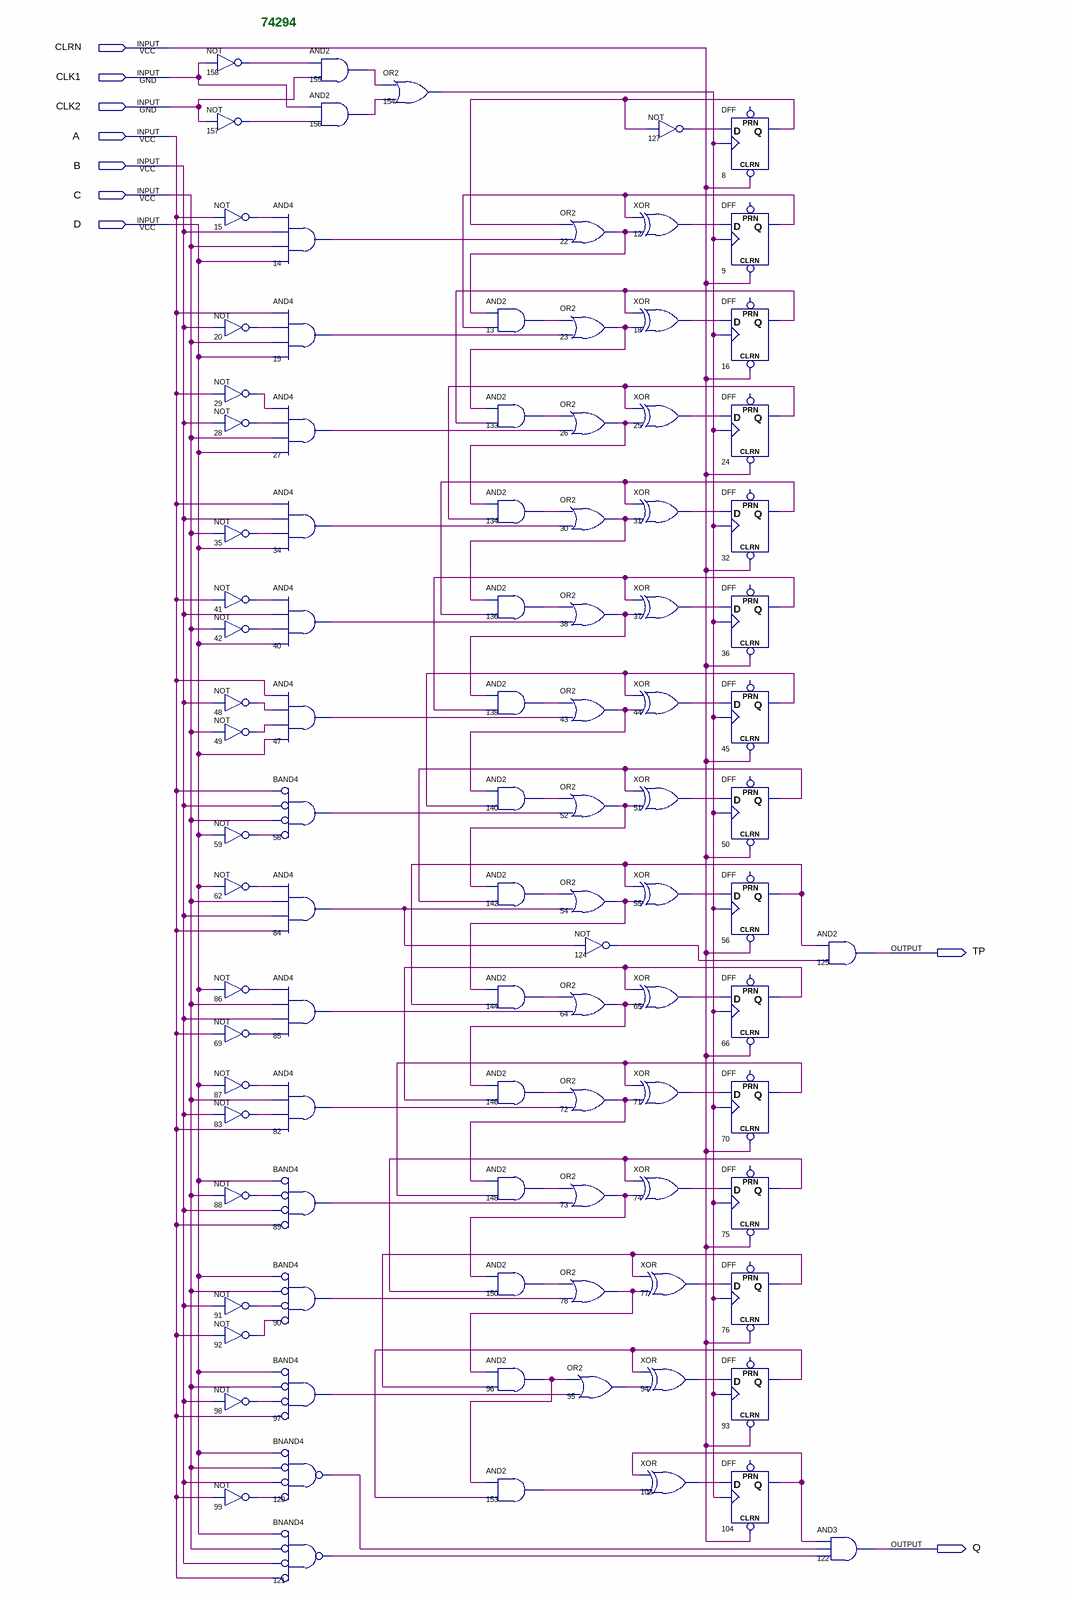
[diagram p0: schematic sheet]
// Quartus schematic 74294.bdf as structural Verilog: 99 symbols, 9 pins
module \74294  (
  input  CLRN,
  input  CLK1,
  input  CLK2,
  input  A,
  input  B,
  input  C,
  input  D,
  output TP,
  output Q
);

  wire n8_q, n9_q, n12_out, n13_out, n14_out, n15_out, n16_q, n18_out, n19_out, n20_out, n22_out, n23_out,
       n24_q, n25_out, n26_out, n27_out, n28_out, n29_out, n30_out, n31_out, n32_q, n34_out, n35_out, n36_q,
       n37_out, n38_out, n40_out, n41_out, n42_out, n43_out, n44_out, n45_q, n47_out, n48_out, n49_out,
       n50_q, n51_out, n52_out, n54_out, n55_out, n56_q, n58_out, n59_out, n62_out, n64_out, n65_out, n66_q,
       n69_out, n70_q, n71_out, n72_out, n73_out, n74_out, n75_q, n76_q, n77_out, n78_out, n82_out, n83_out,
       n84_out, n85_out, n86_out, n87_out, n88_out, n89_out, n90_out, n91_out, n92_out, n93_q, n94_out,
       n95_out, n96_out, n97_out, n98_out, n99_out, n103_out, n104_q, n120_out, n121_out, n124_out, n127_out,
       n133_out, n134_out, n136_out, n138_out, n140_out, n142_out, n144_out, n146_out, n148_out, n150_out,
       n153_out, n154_out, n155_out, n156_out, n157_out, n158_out;

  not u_158 (n158_out, CLK1);
  not u_157 (n157_out, CLK2);
  not u_15 (n15_out, A);
  not u_20 (n20_out, B);
  not u_29 (n29_out, A);
  not u_28 (n28_out, B);
  not u_35 (n35_out, C);
  not u_41 (n41_out, A);
  not u_42 (n42_out, C);
  not u_48 (n48_out, B);
  not u_49 (n49_out, C);
  not u_59 (n59_out, D);
  not u_62 (n62_out, D);
  not u_86 (n86_out, D);
  not u_69 (n69_out, A);
  not u_87 (n87_out, D);
  not u_83 (n83_out, B);
  not u_88 (n88_out, C);
  not u_91 (n91_out, B);
  not u_92 (n92_out, A);
  not u_98 (n98_out, B);
  not u_99 (n99_out, A);
  and u_14 (n14_out, n15_out, B, C, D);
  and u_19 (n19_out, A, n20_out, C, D);
  and u_27 (n27_out, n29_out, n28_out, C, D);
  and u_34 (n34_out, A, B, n35_out, D);
  and u_40 (n40_out, n41_out, B, n42_out, D);
  and u_47 (n47_out, A, n48_out, n49_out, D);
  and u_58 (n58_out, ~A, ~B, ~C, ~n59_out);  // BAND4
  and u_84 (n84_out, n62_out, C, B, A);
  and u_85 (n85_out, n86_out, C, B, n69_out);
  and u_82 (n82_out, n87_out, C, n83_out, A);
  and u_89 (n89_out, ~D, ~n88_out, ~B, ~A);  // BAND4
  and u_90 (n90_out, ~D, ~C, ~n91_out, ~n92_out);  // BAND4
  and u_97 (n97_out, ~D, ~C, ~n98_out, ~A);  // BAND4
  nand u_120 (n120_out, ~D, ~C, ~B, ~n99_out);  // BNAND4
  nand u_121 (n121_out, ~D, ~C, ~B, ~A);  // BNAND4
  and u_155 (n155_out, n158_out, CLK2);
  and u_156 (n156_out, CLK1, n157_out);
  or u_154 (n154_out, n155_out, n156_out);
  and u_13 (n13_out, n22_out, n9_q);
  and u_133 (n133_out, n23_out, n16_q);
  and u_134 (n134_out, n26_out, n24_q);
  and u_136 (n136_out, n30_out, n32_q);
  and u_138 (n138_out, n38_out, n36_q);
  and u_140 (n140_out, n43_out, n45_q);
  and u_142 (n142_out, n52_out, n50_q);
  and u_144 (n144_out, n54_out, n56_q);
  and u_146 (n146_out, n64_out, n66_q);
  and u_148 (n148_out, n72_out, n70_q);
  and u_150 (n150_out, n73_out, n75_q);
  and u_96 (n96_out, n78_out, n76_q);
  and u_153 (n153_out, n96_out, n93_q);
  or u_22 (n22_out, n8_q, n14_out);
  or u_23 (n23_out, n13_out, n19_out);
  or u_26 (n26_out, n133_out, n27_out);
  or u_30 (n30_out, n134_out, n34_out);
  or u_38 (n38_out, n136_out, n40_out);
  or u_43 (n43_out, n138_out, n47_out);
  or u_52 (n52_out, n140_out, n58_out);
  or u_54 (n54_out, n142_out, n84_out);
  not u_124 (n124_out, n84_out);
  or u_64 (n64_out, n144_out, n85_out);
  or u_72 (n72_out, n146_out, n82_out);
  or u_73 (n73_out, n148_out, n89_out);
  or u_78 (n78_out, n150_out, n90_out);
  or u_95 (n95_out, n96_out, n97_out);
  xor u_12 (n12_out, n9_q, n22_out);
  xor u_18 (n18_out, n16_q, n23_out);
  xor u_25 (n25_out, n24_q, n26_out);
  xor u_31 (n31_out, n32_q, n30_out);
  xor u_37 (n37_out, n36_q, n38_out);
  xor u_44 (n44_out, n45_q, n43_out);
  xor u_51 (n51_out, n50_q, n52_out);
  xor u_55 (n55_out, n56_q, n54_out);
  xor u_65 (n65_out, n66_q, n64_out);
  xor u_71 (n71_out, n70_q, n72_out);
  xor u_74 (n74_out, n75_q, n73_out);
  xor u_77 (n77_out, n76_q, n78_out);
  xor u_94 (n94_out, n93_q, n95_out);
  xor u_103 (n103_out, n104_q, n153_out);
  not u_127 (n127_out, n8_q);
  DFF u_8 (.CLRN(CLRN), .CLK(n154_out), .D(n127_out), .Q(n8_q));  // open: PRN
  DFF u_9 (.CLRN(CLRN), .CLK(n154_out), .D(n12_out), .Q(n9_q));  // open: PRN
  DFF u_16 (.CLRN(CLRN), .CLK(n154_out), .D(n18_out), .Q(n16_q));  // open: PRN
  DFF u_24 (.CLRN(CLRN), .CLK(n154_out), .D(n25_out), .Q(n24_q));  // open: PRN
  DFF u_32 (.CLRN(CLRN), .CLK(n154_out), .D(n31_out), .Q(n32_q));  // open: PRN
  DFF u_36 (.CLRN(CLRN), .CLK(n154_out), .D(n37_out), .Q(n36_q));  // open: PRN
  DFF u_45 (.CLRN(CLRN), .CLK(n154_out), .D(n44_out), .Q(n45_q));  // open: PRN
  DFF u_50 (.CLRN(CLRN), .CLK(n154_out), .D(n51_out), .Q(n50_q));  // open: PRN
  DFF u_56 (.CLRN(CLRN), .CLK(n154_out), .D(n55_out), .Q(n56_q));  // open: PRN
  DFF u_66 (.CLRN(CLRN), .CLK(n154_out), .D(n65_out), .Q(n66_q));  // open: PRN
  DFF u_70 (.CLRN(CLRN), .CLK(n154_out), .D(n71_out), .Q(n70_q));  // open: PRN
  DFF u_75 (.CLRN(CLRN), .CLK(n154_out), .D(n74_out), .Q(n75_q));  // open: PRN
  DFF u_76 (.CLRN(CLRN), .CLK(n154_out), .D(n77_out), .Q(n76_q));  // open: PRN
  DFF u_93 (.CLRN(CLRN), .CLK(n154_out), .D(n94_out), .Q(n93_q));  // open: PRN
  DFF u_104 (.CLRN(CLRN), .CLK(n154_out), .D(n103_out), .Q(n104_q));  // open: PRN
  and u_125 (TP, n56_q, n124_out);
  and u_122 (Q, n104_q, n120_out, n121_out);

  // Notes on the sheet:
  //   74294
endmodule
